# EasyEDA Pro project A-fex PowerShell.epro

# Schematic Schematic1
Board Name: Board1; Create Date: 2026-04-11; Page Name: P1; Project Name: A-fex PowerShell; Schematic Name: Schematic1; Update Date: 2026-04-11; Company: EasyEDA.com; Page Size: A4; Version: V1.0
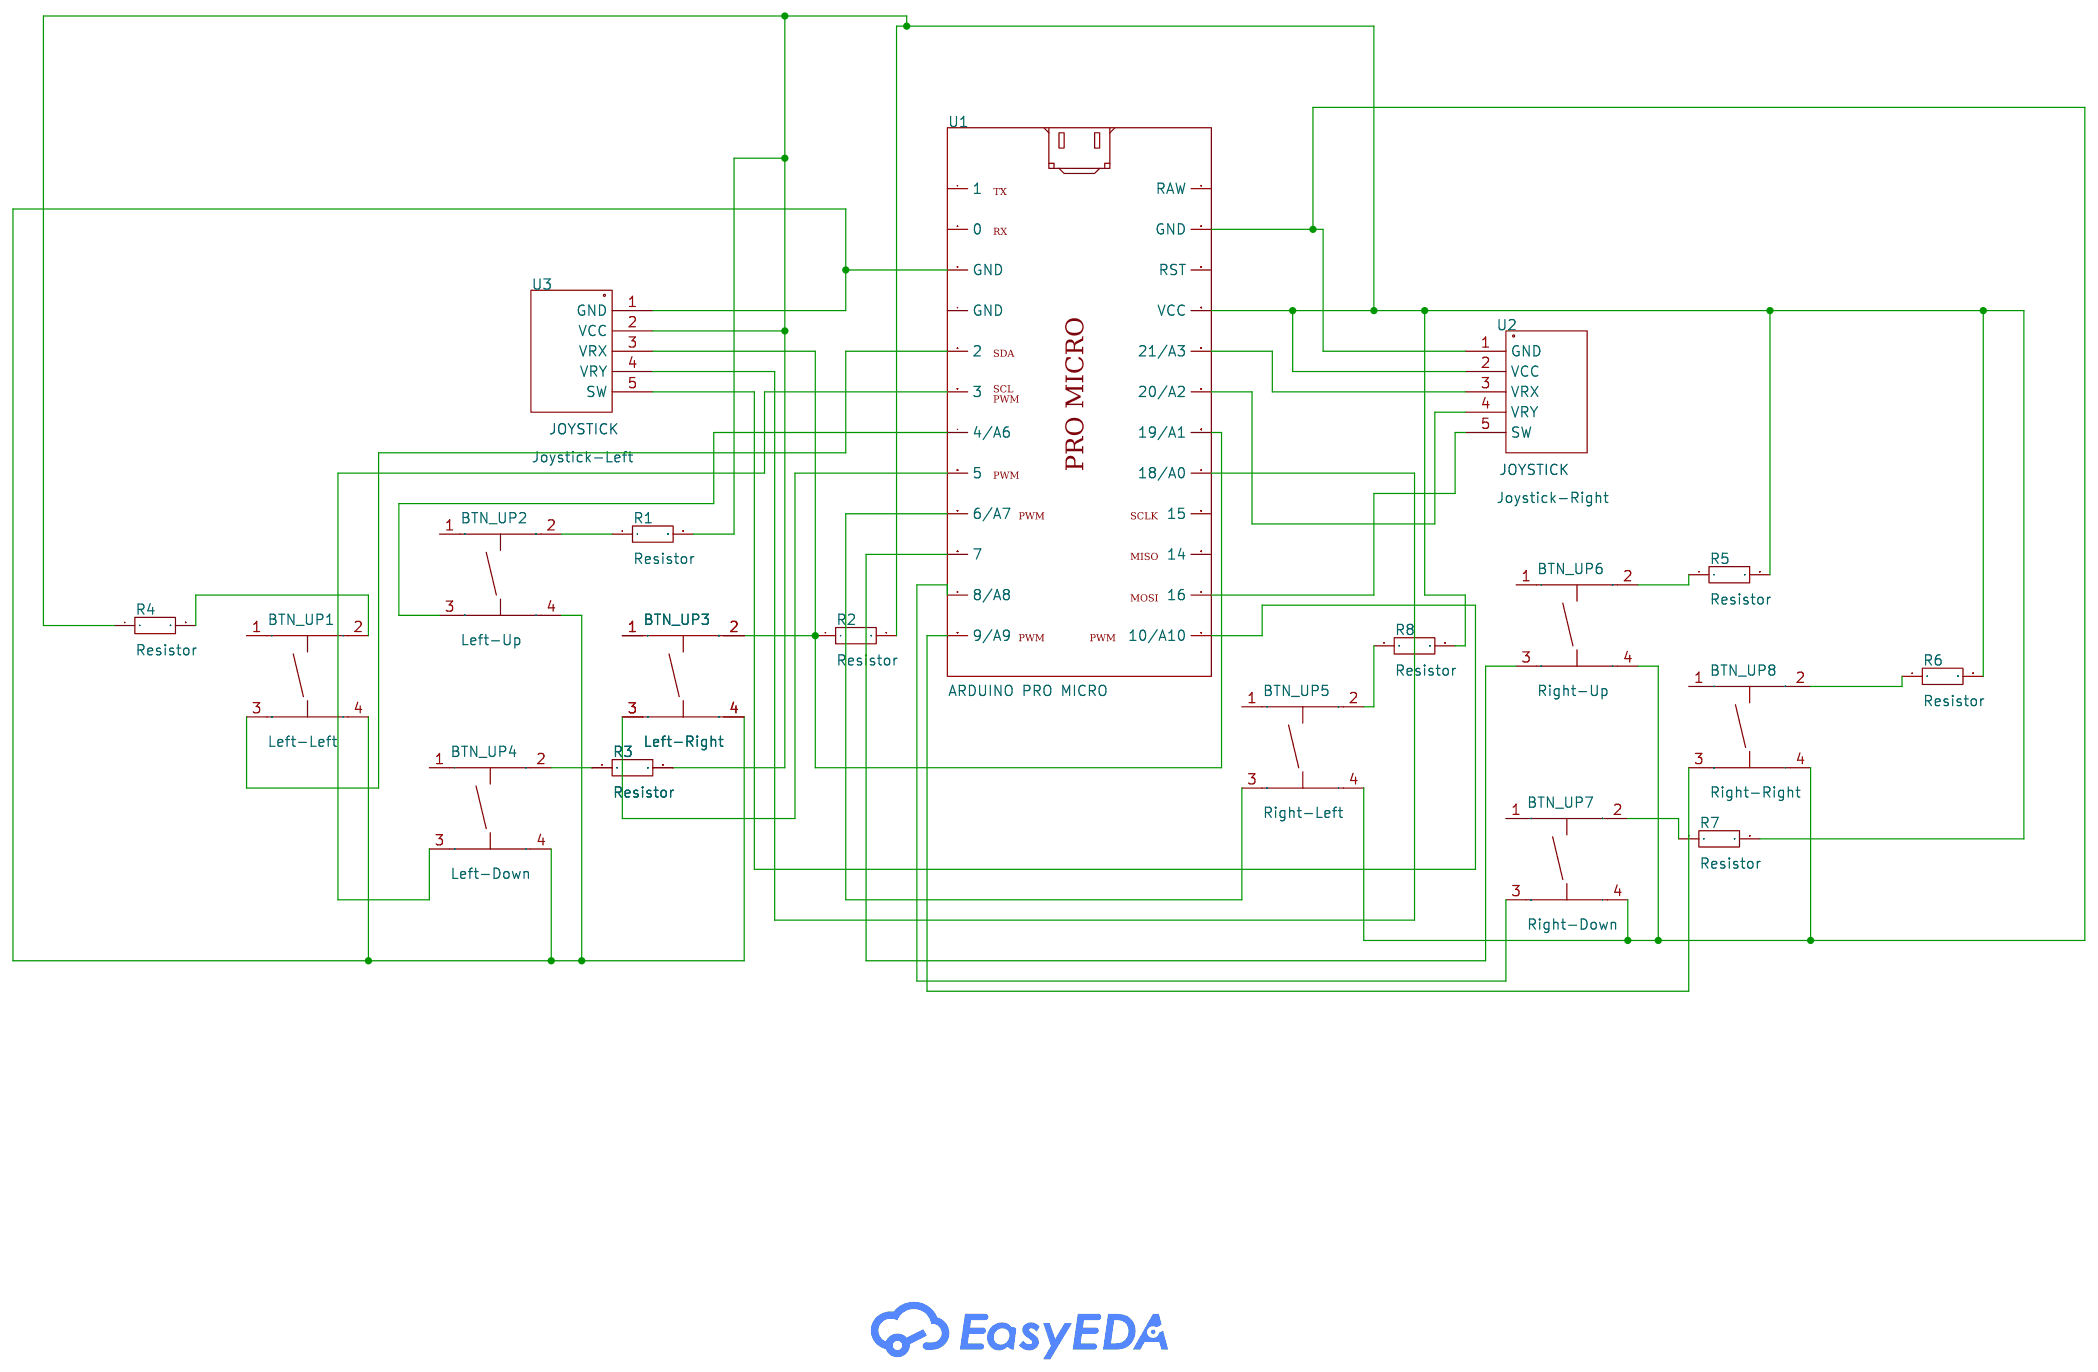
[diagram p0: schematic sheet]

## Parts
BTN_UP1  Left-Left  [SW-TH_4P-L12.0-W12.0-P5.00-LS12.5]
BTN_UP2  Left-Up  [SW-TH_4P-L12.0-W12.0-P5.00-LS12.5]
BTN_UP3  Left-Right  [SW-TH_4P-L12.0-W12.0-P5.00-LS12.5]
BTN_UP4  Left-Down  [SW-TH_4P-L12.0-W12.0-P5.00-LS12.5]
BTN_UP5  Right-Left  [SW-TH_4P-L12.0-W12.0-P5.00-LS12.5]
BTN_UP6  Right-Up  [SW-TH_4P-L12.0-W12.0-P5.00-LS12.5]
BTN_UP7  Right-Down  [SW-TH_4P-L12.0-W12.0-P5.00-LS12.5]
BTN_UP8  Right-Right  [SW-TH_4P-L12.0-W12.0-P5.00-LS12.5]
R1  Resistor  [Resistor 1/8w 7mm metal film]
R2  Resistor  [Resistor 1/8w 7mm metal film]
R3  Resistor  [Resistor 1/8w 7mm metal film]
R4  Resistor  [Resistor 1/8w 7mm metal film]
R5  Resistor  [Resistor 1/8w 7mm metal film]
R6  Resistor  [Resistor 1/8w 7mm metal film]
R7  Resistor  [Resistor 1/8w 7mm metal film]
R8  Resistor  [Resistor 1/8w 7mm metal film]
U1  ARDUINO PRO MICRO  [ARDUINO MICRO PRO]
U2  Joystick-Right  [JOYSTICK]
U3  Joystick-Left  [JOYSTICK]

## Library data of the parts
BTN_UP1-BTN_UP8 = 12X12X7.3 PLAIN TACTILE PUSHBUTTON: Supplier: LCSC; Supplier Part: C10861; Manufacturer: Boom Precision Elec; JLCPCB Part Class: Extend; Paste Type: expand
R1-R8 = resistor: Supplier: LCSC; Manufacturer: UNI-ROYAL(Uniroyal Elec); Manufacturer Part: 1206W4F1002T5E; Supplier Part: C17902; Resistance: 10KΩ; JLCPCB Part Class: Basic Part; Datasheet: https://datasheet.lcsc.com/lcsc/2206010145_UNI-ROYAL-Uniroyal-Elec-1206W4F1002T5E_C17902.pdf
U1 = ARDUINO PRO MICRO: Arduino Pro Micro ATMEGA32U4; Manufacturer Part: Arduino Micro Pro
U2 U3 = JOYSTICK

## Nets
$1N1081: BTN_UP1.4 BTN_UP2.4 BTN_UP3.4 BTN_UP4.4 U1.3(GND) U3.1(GND)
$1N1296: BTN_UP6.2 R5.1
$1N1304: BTN_UP8.2 R6.1
$1N1349: BTN_UP7.2 R7.1
$1N1364: R1.2 R2.2 R3.2 R4.1 R5.2 R6.2 R7.2 R8.2 U1.21(VCC) U2.2(VCC) U3.2(VCC)
$1N1456: BTN_UP6.3 U1.10(7)
$1N1467: BTN_UP7.3 U1.11(8/A8)
$1N1482: BTN_UP8.3 U1.12(9/A9)
$1N1525: BTN_UP5.3 U1.9(6/A7)
$1N1544: BTN_UP5.4 BTN_UP6.4 BTN_UP7.4 BTN_UP8.4 U1.23(GND) U2.1(GND)
$1N1548: BTN_UP2.2 R1.1
$1N1557: BTN_UP4.2 R3.1
$1N1562: BTN_UP1.2 R4.2
$1N1788: BTN_UP3.3 U1.8(5)
$1N1798: BTN_UP2.3 U1.7(4/A6)
$1N1857: BTN_UP4.3 U1.6(3)
$1N1866: BTN_UP1.3 U1.5(2)
$1N1900: BTN_UP3.2 R2.1 U1.18(19/A1) U3.3(VRX)
$1N1912: BTN_UP5.2 R8.1
$1N1929: U1.17(18/A0) U3.4(VRY)
$1N1943: U1.13(10/A10) U3.5(SW)
$1N1961: U1.20(21/A3) U2.3(VRX)
$1N2003: U1.19(20/A2) U2.4(VRY)
$1N2007: U1.14(16) U2.5(SW)

Not connected (* = marked no-connect by the designer): BTN_UP1 1; BTN_UP2 1; BTN_UP3 1; BTN_UP4 1; BTN_UP5 1; BTN_UP6 1; BTN_UP7 1; BTN_UP8 1; U1 1 2(0) 4(GND) 15(14) 16(15) 22(RST) 24(RAW)

# Board PCB1
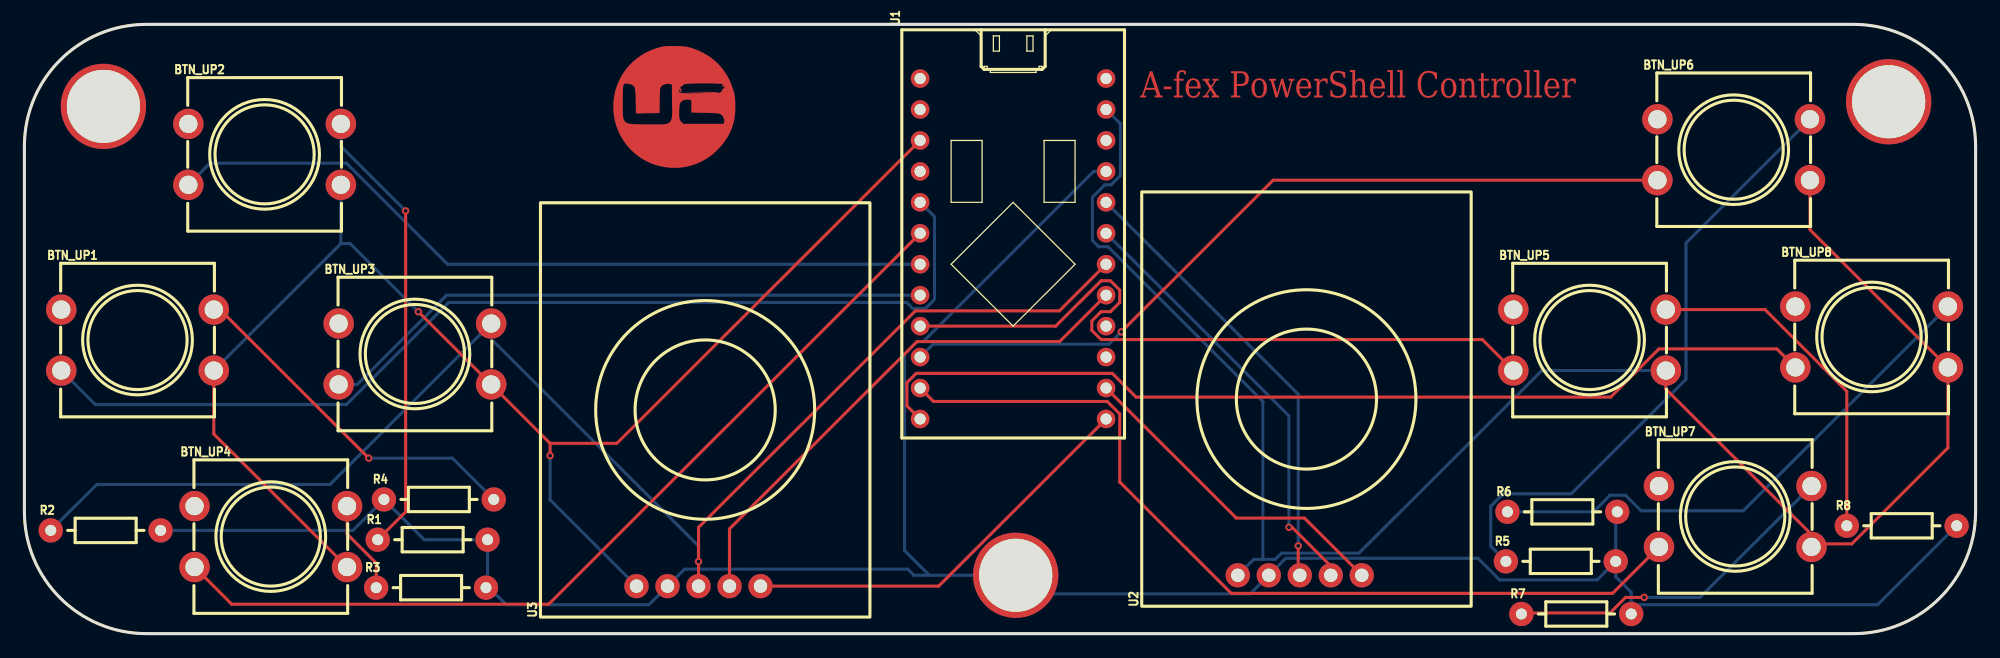
[diagram p1: board, top side]
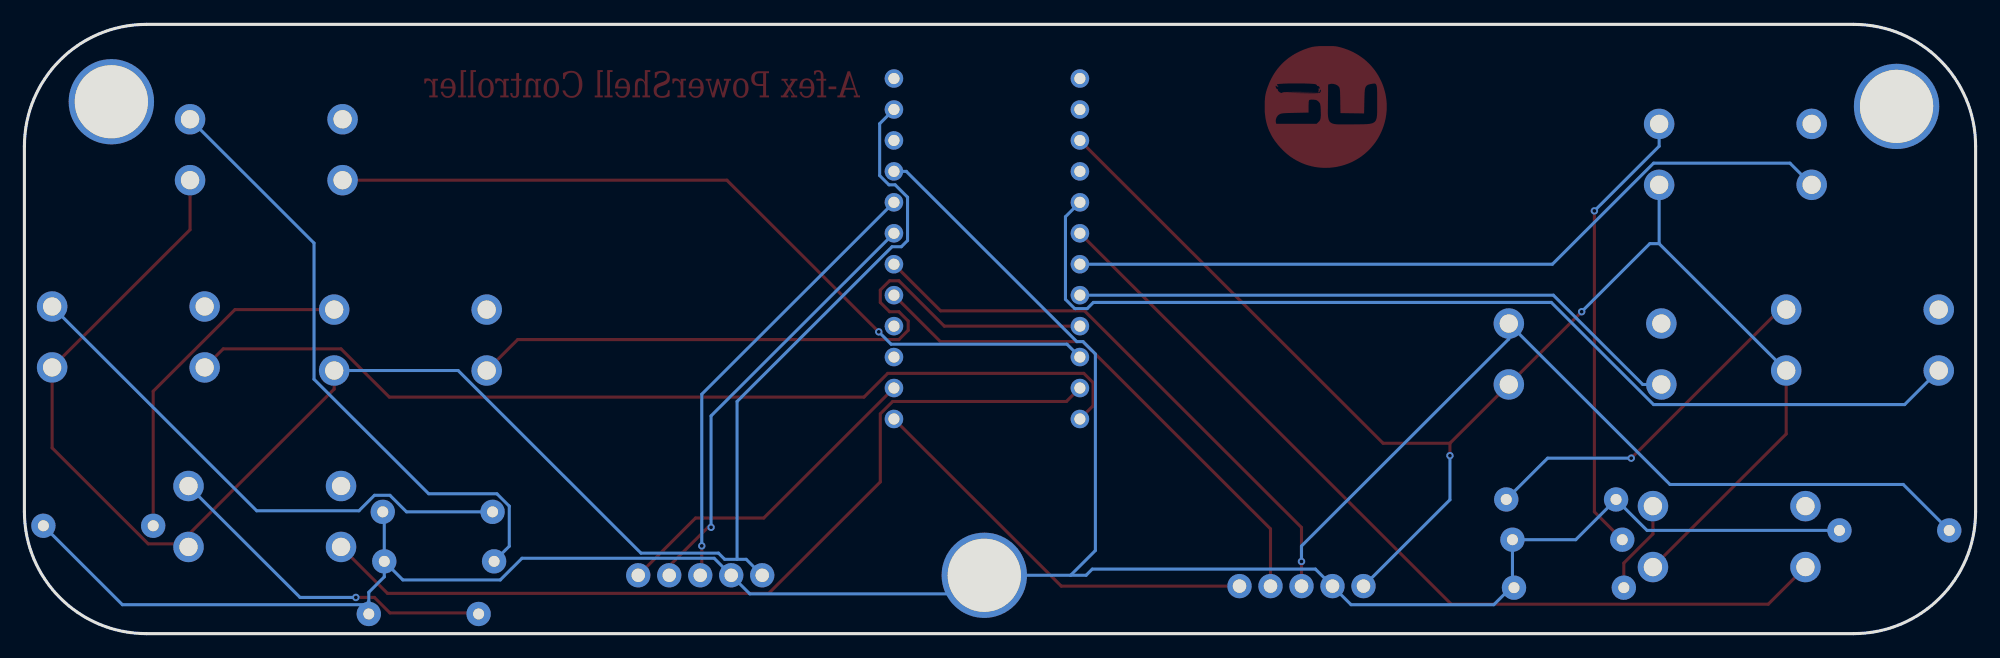
[diagram p2: board, bottom side, seen from below]

Outline 159.91 x 50 mm; copper layers: Top Layer, Bottom Layer. Coordinates in mm from the lower left corner of the outline.
Outline path: 0,40 0,10 arc(2.93,2.93) 10,0 149.91,0 arc(156.98,2.93) 159.91,10 159.91,40 arc(156.98,47.07) 149.91,50 10,50 arc(2.93,47.07) 0,40
Stack: Top Layer 0.035mm / Dielectric1 1.51mm FR4 er 4.5 / Bottom Layer 0.035mm

## Design rules (mm)
template: JLCPCB Capability(Two Layers Board)
spacing copperThickness1oz (default): track to track 0.102, other pairs 0.152 to 0.3
spacing copperThickness2oz: track to track 0.203, other pairs 0.152 to 0.3
track width copperThickness1oz (default): min 0.127, default 0.254, max 2.54
track width copperThickness2oz: min 0.203, default 0.254, max 2.54
differential pair differentialPair (default): width min 0.127, default 0.254, max 2.54; gap min 0.152, default 0.152
via viaSize (default): diameter min 0.5, default 0.61, max 10; hole min 0.3, default 0.305, max 6.3

## Placement (name value [footprint] x y rotation side)
BTN_UP1  Left-Left  [SW-TH_4P-L12.0-W12.0-P5.00-LS12.5]  9.27 24.09 0 top
BTN_UP2  Left-Up  [SW-TH_4P-L12.0-W12.0-P5.00-LS12.5]  19.69 39.33 0 top
BTN_UP3  Left-Right  [SW-TH_4P-L12.0-W12.0-P5.00-LS12.5]  32 22.95 0 top
BTN_UP4  Left-Down  [SW-TH_4P-L12.0-W12.0-P5.00-LS12.5]  20.19 7.96 0 top
BTN_UP5  Right-Left  [SW-TH_4P-L12.0-W12.0-P5.00-LS12.5]  128.27 24.09 0 top
BTN_UP6  Right-Up  [SW-TH_4P-L12.0-W12.0-P5.00-LS12.5]  140.08 39.71 0 top
BTN_UP7  Right-Down  [SW-TH_4P-L12.0-W12.0-P5.00-LS12.5]  140.21 9.61 0 top
BTN_UP8  Right-Right  [SW-TH_4P-L12.0-W12.0-P5.00-LS12.5]  151.38 24.35 0 top
NOREF  -  [Pad_e1524]  81.24 4.79 0 top
NOREF#2  -  [Pad_e1520]  6.48 43.27 0 top
NOREF#3  -  [Pad_e1522]  152.78 43.65 0 top
R1  Resistor  [Resistor 1/8w 7mm metal film]  28.96 7.71 0 top
R2  Resistor  [Resistor 1/8w 7mm metal film]  2.16 8.47 0 top
R3  Resistor  [Resistor 1/8w 7mm metal film]  28.83 3.77 0 top
R4  Resistor  [Resistor 1/8w 7mm metal film]  29.46 11.01 0 top
R5  Resistor  [Resistor 1/8w 7mm metal film]  121.41 5.93 0 top
R6  Resistor  [Resistor 1/8w 7mm metal film]  121.54 10 0 top
R7  Resistor  [Resistor 1/8w 7mm metal film]  122.68 1.61 0 top
R8  Resistor  [Resistor 1/8w 7mm metal film]  149.35 8.85 0 top
U1  ARDUINO PRO MICRO  [ARDUINO MICRO PRO]  73.41 45.56 0 top
U2  Joystick-Right  [JOYSTICK]  91.57 2.25 90 top
U3  Joystick-Left  [JOYSTICK]  42.29 1.36 90 top

## Footprints (pads in the part's own frame, mm; a bottom-side part is the same pattern mirrored in y, then rotated)
ARDUINO MICRO PRO
  round 1.524 hole 0.914: 1(0,0) 2(0,-2.54) 3(0,-5.08) 4(0,-7.62) 5(0,-10.16) 6(0,-12.7) 7(0,-15.24) 8(0,-17.78) 9(0,-20.32) 10(0,-22.86) 11(0,-25.4) 12(0,-27.94) 13(15.24,-27.94) 14(15.24,-25.4) 15(15.24,-22.86) 16(15.24,-20.32) 17(15.24,-17.78) 18(15.24,-15.24) 19(15.24,-12.7) 20(15.24,-10.16) 21(15.24,-7.62) 22(15.24,-5.08) 23(15.24,-2.54) 24(15.24,0)
JOYSTICK
  round 2 hole 1.1: 1(2.54,-7.874) 2(2.54,-10.414) 3(2.54,-12.954) 4(2.54,-15.494) 5(2.54,-18.034)
Pad_e1520
  round 7 hole 6: 1(0,0)
Pad_e1522
  round 7 hole 6: 1(0,0)
Pad_e1524
  round 7 hole 6: 1(0,0)
Resistor 1/8w 7mm metal film
  round 2 hole 0.9: 1(0,0) 2(9,0)
SW-TH_4P-L12.0-W12.0-P5.00-LS12.5
  round 2.5 hole 1.5: 1(-6.25,2.5) 2(6.25,2.5) 3(-6.25,-2.5) 4(6.25,-2.5)

## Nets
As in the schematic, except:
$1N1364: NOREF.1 R1.2 R2.2 R3.2 R4.1 R5.2 R6.2 R7.2 R8.2 U1.21 U2.2 U3.2

Pads without a net: BTN_UP1 1; BTN_UP2 1; BTN_UP3 1; BTN_UP4 1; BTN_UP5 1; BTN_UP6 1; BTN_UP7 1; BTN_UP8 1; NOREF#2 1; NOREF#3 1; U1 1 2 4 15 16 22 24

## Via types
v1: diameter 0.61, hole 0.305, Top Layer to Bottom Layer, 9 vias

## Routing (per net, layer and track width the routed paths; a pad name or vN(x,y) marks a point on that pad's centre or on a via; arc(x,y) is an arc through that point)
$1N1081: length 119.4
  Top Layer w0.254: BTN_UP4.4 15.52,16.39 BTN_UP1.4 ; 43.08,15.62 BTN_UP3.4 v1(32.29,26.42) ; 43.08,15.62 v1(43.08,14.61) ; 43.08,15.62 48.55,15.62 U1.3
  Bottom Layer w0.254: 25.94,32.01 BTN_UP2.4 ; 25.94,32.01 BTN_UP1.4 ; 25.94,32.01 26.7,32.01 v1(32.29,26.42) ; U3.1 43.08,10.98 v1(43.08,14.61)
$1N1296: length 50.9
  Bottom Layer w0.254: R5.1 120.17,7.17 120.17,10.46 121.19,11.48 126.77,11.48 136.17,20.88 136.17,32.05 BTN_UP6.2
$1N1304: length 44.1
  Bottom Layer w0.254: R6.1 128.59,10 129.95,11.35 131.22,11.35 132.49,10.08 140.87,10.08 BTN_UP8.2
$1N1349: length 28.1
  Top Layer w0.254: R7.1 122.77,1.7 129.95,1.7 131.22,2.97 v1(132.74,2.97)
  Bottom Layer w0.254: v1(132.74,2.97) 137.31,2.97 BTN_UP7.2
$1N1364: length 211.1
  Bottom Layer w0.254: 131.68,2.63 131.94,2.38 151.88,2.38 R8.2 ; 131.68,2.63 R7.2 ; 131.68,2.63 131.68,3.39 130.41,4.66 R5.2 ; 74.17,4.79 NOREF.1 82.77,3.26 100.46,3.26 U2.2 103.38,6.19 119.13,6.19 120.9,4.41 128.89,4.41 R5.2 ; 74.17,4.79 72.9,4.79 72.39,5.3 54.1,5.3 U3.2 51.18,2.38 39.48,2.38 37.96,3.9 ; 74.17,4.79 72.14,6.82 72.14,22.95 73.15,23.97 73.66,23.97 87.63,37.94 U1.21 ; R5.2 130.41,9.87 R6.2 ; 37.96,3.9 R1.2 32.77,7.71 R4.1 26.92,8.47 R2.2 ; 37.96,3.9 R3.2
$1N1456: length 66.4
  Top Layer w0.254: BTN_UP6.3 102.34,37.21 v1(89.89,24.77)
  Bottom Layer w0.254: v1(89.89,24.77) 88.87,23.75 74.46,23.75 U1.10
$1N1467: length 72.4
  Top Layer w0.254: U1.11 74.51,19.05 88.75,19.05 89.76,18.04 89.76,12.45 98.91,3.3 130.15,3.3 BTN_UP7.3
$1N1482: length 79.6
  Top Layer w0.254: BTN_UP8.3 143.61,23.37 133.96,23.37 130,19.41 91.1,19.41 89.15,21.36 73.09,21.36 72.32,20.6 72.32,18.7 U1.12
$1N1525: length 58.8
  Top Layer w0.254: U1.9 84.52,25.24 88.24,28.96 89,28.96 89.76,28.2 89.76,27.18 89,26.42 88.24,26.42 87.48,25.66 87.48,24.89 88.24,24.13 119.48,24.13 BTN_UP5.3
$1N1544: length 147.4
  Top Layer w0.254: 146.46,7.37 146.46,8.13 134.52,20.07 BTN_UP5.4 ; 146.46,7.37 BTN_UP7.4 ; 146.46,7.37 149.76,7.37 157.63,15.24 BTN_UP8.4 146.33,33.15 BTN_UP6.4
  Bottom Layer w0.254: U2.1 100.75,6.1 101.5,6.1 ; BTN_UP5.4 124.36,21.59 109.37,6.61 103.02,6.61 102.52,6.1 101.5,6.1 ; U1.23 89.82,41.85 89.82,37.59 89.05,36.83 88.55,36.83 87.53,35.82 87.53,32.26 88.04,31.75 88.8,31.75 101.5,19.05 101.5,6.1
$1N1548: length 37.3
  Top Layer w0.254: v1(31.24,34.69) 31.24,10 R1.1
  Bottom Layer w0.254: BTN_UP2.2 25.94,40 v1(31.24,34.69)
$1N1557: length 7.7
  Top Layer w0.254: R3.1 28.83,5.79 26.44,8.18 BTN_UP4.2
$1N1562: length 29.4
  Top Layer w0.254: v1(28.22,14.4) 16.03,26.59 BTN_UP1.2
  Bottom Layer w0.254: v1(28.22,14.4) 35.08,14.4 R4.2
$1N1788: length 50.7
  Bottom Layer w0.254: U1.8 34.6,27.78 27.28,20.45 BTN_UP3.3
$1N1798: length 64.1
  Bottom Layer w0.254: U1.7 34.68,30.32 26.39,38.61 15.21,38.61 BTN_UP2.3
$1N1857: length 73.3
  Top Layer w0.254: BTN_UP4.3 16.99,2.42 42.97,2.42 U1.6
$1N1866: length 85.2
  Bottom Layer w0.254: U1.5 74.59,34.21 74.59,27.43 73.83,26.67 72.81,26.67 72.3,27.18 34.77,27.18 26.39,18.8 5.81,18.8 BTN_UP1.3
$1N1900: length 116.9
  Top Layer w0.254: U1.18 84.82,26.49 73.03,26.49 55.25,8.71 v1(55.25,5.92) U3.3
  Bottom Layer w0.254: R2.1 5.93,12.24 25.05,12.24 BTN_UP3.2 38.25,24.18 55.25,7.19 v1(55.25,5.92)
$1N1912: length 28.6
  Top Layer w0.254: BTN_UP5.2 142.65,26.59 149.35,19.89 R8.1
$1N1929: length 43.5
  Top Layer w0.254: U3.4 57.79,8.6 73.15,23.97 84.84,23.97 U1.17
$1N1943: length 34
  Top Layer w0.254: U1.13 74.93,3.9 U3.5
$1N1961: length 37.2
  Top Layer w0.254: U2.3 104.39,4.92 v1(104.39,7.2)
  Bottom Layer w0.254: U1.20 104.39,19.65 v1(104.39,7.2)
$1N2003: length 35.8
  Top Layer w0.254: U2.4 106.93,4.92 106.93,5.68 103.89,8.73 v1(103.63,8.73)
  Bottom Layer w0.254: U1.19 103.63,17.87 v1(103.63,8.73)
$1N2007: length 27.3
  Top Layer w0.254: U1.14 99.31,9.49 104.9,9.49 U2.5

Small or netless copper shapes (teardrops, artwork), in the pictures only: 1 on Top Layer

## Text on the board
Top Layer: A-fex PowerShell Controller
